# Altium project Filter.PrjPcb
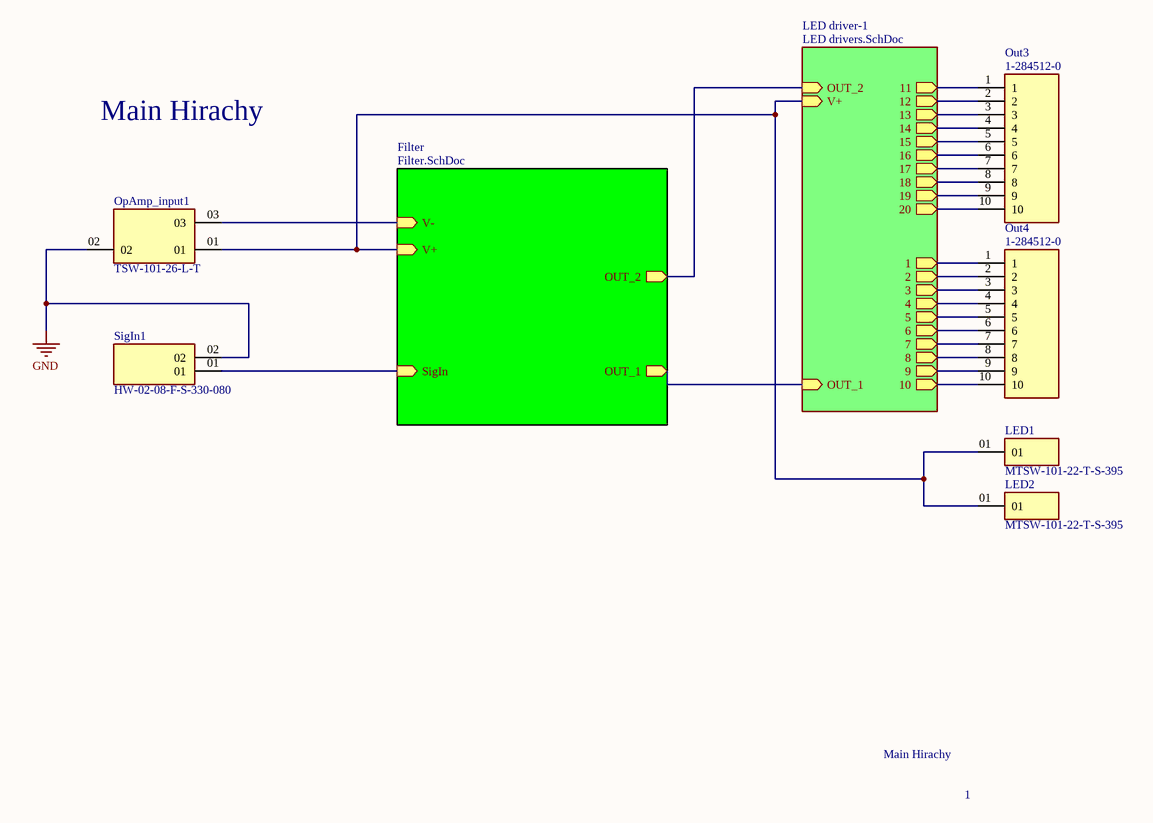
[diagram p0: main.SchDoc]
3 sheets, 29 parts. Net scope: hierarchical (ports join the sheet entries above them; power ports are global).
Board file: PCB_Filter.PcbDoc
Sheets:
  main.SchDoc
    Filter = Filter.SchDoc
    LED driver-1 = LED drivers.SchDoc

## Sheet main.SchDoc
size A4; SheetNumber: 1; SheetTotal: 3

### Parts
LED1  MTSW-101-22-T-S-395  [SAMTEC_MTSW-101-22-T-S-395]
LED2  MTSW-101-22-T-S-395  [SAMTEC_MTSW-101-22-T-S-395]
OpAmp_input1  TSW-101-26-L-T  [SAMTEC_TSW-101-26-L-T]
Out3  1-284512-0  [TE_1-284512-0]
Out4  1-284512-0  [TE_1-284512-0]
SigIn1  HW-02-08-F-S-330-080  [SAMTEC_HW-02-08-F-S-330-080]

### Sub-sheets
Filter = Filter.SchDoc: OUT_1 (out), OUT_2 (out), SigIn (in), V+ (in), V- (in)
LED driver-1 = LED drivers.SchDoc: 10 (out), 9 (out), 8 (out), 7 (out), 6 (out), 5 (out), 4 (out), 3 (out), 2 (out), 1 (out), OUT_1 (in), 20 (out), 19 (out), 18 (out), 17 (out), 16 (out), 15 (out), 14 (out), 13 (out), 12 (out), 11 (out), OUT_2 (in), V+ (in)

### Nets
GND: OpAmp_input1.02 SigIn1.02
Out1: sheet Filter/OUT_1, sheet LED driver-1/OUT_1
Out2: sheet Filter/OUT_2, sheet LED driver-1/OUT_2
NetIC3_1: Out4.1 ; sheet LED driver-1/1
NetIC3_3: LED1.01 LED2.01 OpAmp_input1.01 ; sheet Filter/V+, sheet LED driver-1/V+
NetIC3_10: Out4.10 ; sheet LED driver-1/10
NetIC3_11: Out4.9 ; sheet LED driver-1/9
NetIC3_12: Out4.8 ; sheet LED driver-1/8
NetIC3_13: Out4.7 ; sheet LED driver-1/7
NetIC3_14: Out4.6 ; sheet LED driver-1/6
NetIC3_15: Out4.5 ; sheet LED driver-1/5
NetIC3_16: Out4.4 ; sheet LED driver-1/4
NetIC3_17: Out4.3 ; sheet LED driver-1/3
NetIC3_18: Out4.2 ; sheet LED driver-1/2
NetIC4_1: Out3.1 ; sheet LED driver-1/11
NetIC4_10: Out3.10 ; sheet LED driver-1/20
NetIC4_11: Out3.9 ; sheet LED driver-1/19
NetIC4_12: Out3.8 ; sheet LED driver-1/18
NetIC4_13: Out3.7 ; sheet LED driver-1/17
NetIC4_14: Out3.6 ; sheet LED driver-1/16
NetIC4_15: Out3.5 ; sheet LED driver-1/15
NetIC4_16: Out3.4 ; sheet LED driver-1/14
NetIC4_17: Out3.3 ; sheet LED driver-1/13
NetIC4_18: Out3.2 ; sheet LED driver-1/12
NetOpAmp_input1_03: OpAmp_input1.03 ; sheet Filter/V-
NetR14_1: SigIn1.01 ; sheet Filter/SigIn

### Notes on the sheet
- Main Hirachy
- 1

### Library data of the parts
LED1 LED2 = MTSW-101-22-T-S-395: Connector Header Through Hole 1 position; MF: Samtec; Package: None; Value: *; Check_prices: https://www.snapeda.com/parts/MTSW-101-22-T-S-395/Samtec/view-part/?ref=eda; SnapEDA_Link: https://www.snapeda.com/parts/MTSW-101-22-T-S-395/Samtec/view-part/?ref=snap; Availability: In Stock; Price: None; MP: MTSW-101-22-T-S-395; Purchase-URL: https://pricing.snapeda.com/search/part/MTSW-101-22-T-S-395/?ref=eda
Out3 Out4 = 1-284512-0: 10 POS TERMI-BLOK HDR 900 POLA; Number_of_Positions: 10; MF: TE Connectivity; Centerline_Pitch: 3.5 mm[.138 in]; Package: None; TE_purchase_URL: https://www.te.com/usa-en/product-1-284512-0.html?te_bu=Cor&te_type=disp&te_campaign=seda_glo_cor-seda-global-disp-prtnr-fy19-seda-model-bom-cta_sma-317_1&elqCampaignId=32493; Value: *; SnapEDA_Link: https://www.snapeda.com/parts/1-284512-0/TE%20Connectivity%20AMP%20Connectors/view-part/2366032/?ref=snap; Price: None; MP: 1-284512-0; Availability: Unavailable; EU_RoHS_Compliance: Compliant
OpAmp_input1 = TSW-101-26-L-T: Package: None; Price: None; Value: *; MP: TSW-101-26-L-T; Availability: Unavailable
SigIn1 = HW-02-08-F-S-330-080: Availability: Unavailable; Price: None; Package: None; MP: HW-02-08-F-S-330-080; Value: *

## Sheet Filter.SchDoc
size A4; SheetNumber: 2; SheetTotal: 3
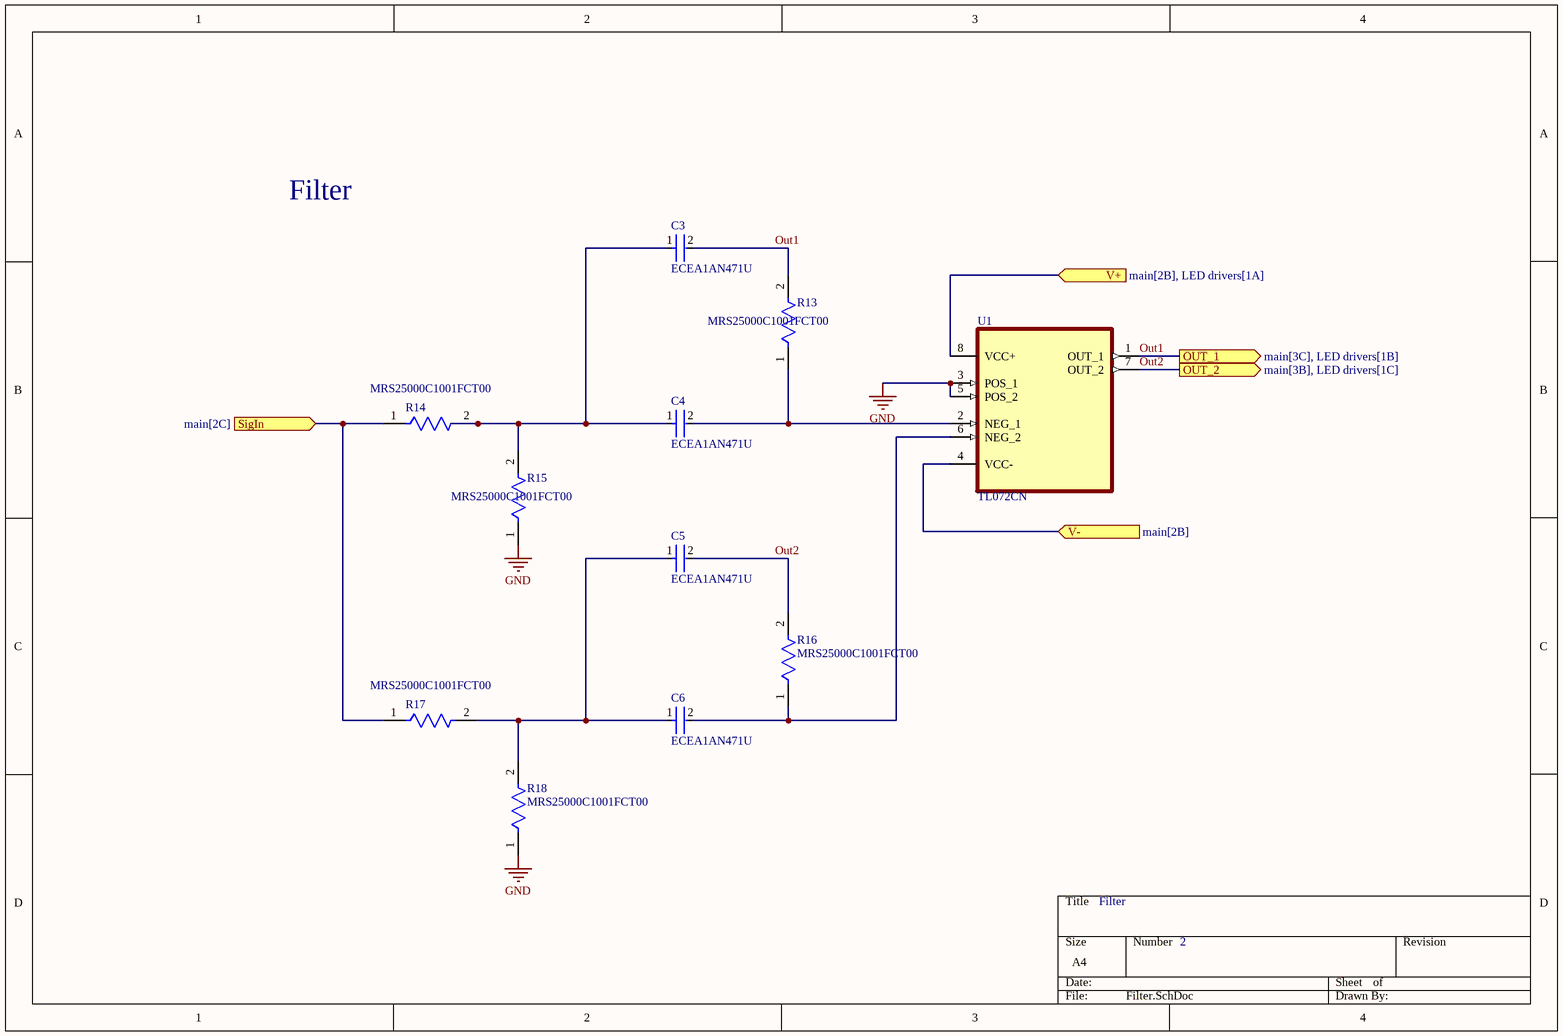
[diagram p1: Filter.SchDoc]

### Parts
C3  ECEA1AN471U  [FP-RAD-TH-D_10_0_5-L_16_1-MFG]
C4  ECEA1AN471U  [FP-RAD-TH-D_10_0_5-L_16_1-MFG]
C5  ECEA1AN471U  [FP-RAD-TH-D_10_0_5-L_16_1-MFG]
C6  ECEA1AN471U  [FP-RAD-TH-D_10_0_5-L_16_1-MFG]
R13  MRS25000C1001FCT00  [FP-MRS25-MFG]
R14  MRS25000C1001FCT00  [FP-MRS25-MFG]
R15  MRS25000C1001FCT00  [FP-MRS25-MFG]
R16  MRS25000C1001FCT00  [FP-MRS25-MFG]
R17  MRS25000C1001FCT00  [FP-MRS25-MFG]
R18  MRS25000C1001FCT00  [FP-MRS25-MFG]
U1  TL072CN  [DIP254P762X533-8]

### Ports
OUT_1 (out, see main[3C], LED drivers[1B]), OUT_2 (out, see main[3B], LED drivers[1C]), SigIn (in, see main[2C]), V+ (in, see main[2B], LED drivers[1A]), V- (in, see main[2B])

### Nets
GND: R15.1 R18.1 U1.3(POS_1) U1.5(POS_2)
Out1: C3.2 R13.2 U1.1(OUT_1) ; port OUT_1
Out2: C5.2 R16.2 U1.7(OUT_2) ; port OUT_2
NetC3_1: C3.1 C4.1 R14.2 R15.2
NetC4_2: C4.2 R13.1 U1.2(NEG_1)
NetC5_1: C5.1 C6.1 R17.2 R18.2
NetC6_2: C6.2 R16.1 U1.6(NEG_2)
NetIC3_3: U1.8(VCC+) ; port V+
NetOpAmp_input1_03: U1.4(VCC-) ; port V-
NetR14_1: R14.1 R17.1 ; port SigIn

### Notes on the sheet
- Filter
- 2

### Library data of the parts
C3-C6 = CMP-05427-001928-1: Aluminum Electrolytic Capacitors (Radial Lead Type) 470uF ±20% 10V; Lead Diameter: 0.6mm; Dissipation Factor: 0.25%; Life (Hours): 2000Hour; Leakage Current: 3uA; Ripple Current: 340mA; Mount: Through Hole; REACH SVHC: No SVHC; Height: 16mm; Max Operating Temperature: 85°C; Case/Package: Radial; Packaging: Bulk; RoHS Compliant: Yes; Min Operating Temperature: -40°C; Termination: Radial; Height - Seated (Max): 0.63inch; Series: SU; Construction: RADIAL; Capacitance: 470uF; Tolerance: 20%; Radiation Hardening: No; Voltage Rating (DC): 10V; Lead Free: Lead Free; Diameter: 10mm; Lead Pitch: 5mm; Voltage Rating: 10V; Length: 16mm; Voltage: 10V; Package Quantity: 200
R13-R18 = CMP-02408-000051-1: RES 1K OHM 0.6W 1% AXIAL; Power Rating: 600mW; Lead Diameter: 0.6mm; Voltage Rating (DC): 350V; Resistance: 1kR; Temperature Coefficient: 50ppm/°C; Width: 2.5mm; Military Standard: Not; Package Quantity: 5000; Radiation Hardening: No; Case/Package: Axial; Resistance Tolerance: 1%; Resistor Type: Metal Film; Contact Plating: Tin; Length: 6.5mm; Lead Free: Lead Free; RoHS Compliant: Yes; Mount: Through Hole; Number of Pins: 2; Technology: THIN FILM; Voltage Rating: 350V; Min Operating Temperature: -55°C; Weight: 0.00776oz; Diameter: 2.5mm; Construction: Cylindrical; Series: MRS25; Tolerance: 1%; Packaging: Tape and Reel; Max Operating Temperature: 155°C; Max Power Dissipation: 600mW; Number of Terminations: 2; Termination: Axial
U1 = TL072CN: J-FET Amplifier 2 Circuit 8-DIP; MF: Texas Instruments; Price: None; Package: DIP-8 Texas Instruments; MP: TL072CN; Value: *; Availability: Unavailable; SnapEDA_Link: https://www.snapeda.com/parts/TL072CN/Texas%20Instruments/view-part/576842/?ref=snap

## Sheet LED drivers.SchDoc
size A4; SheetNumber: 3; SheetTotal: 3
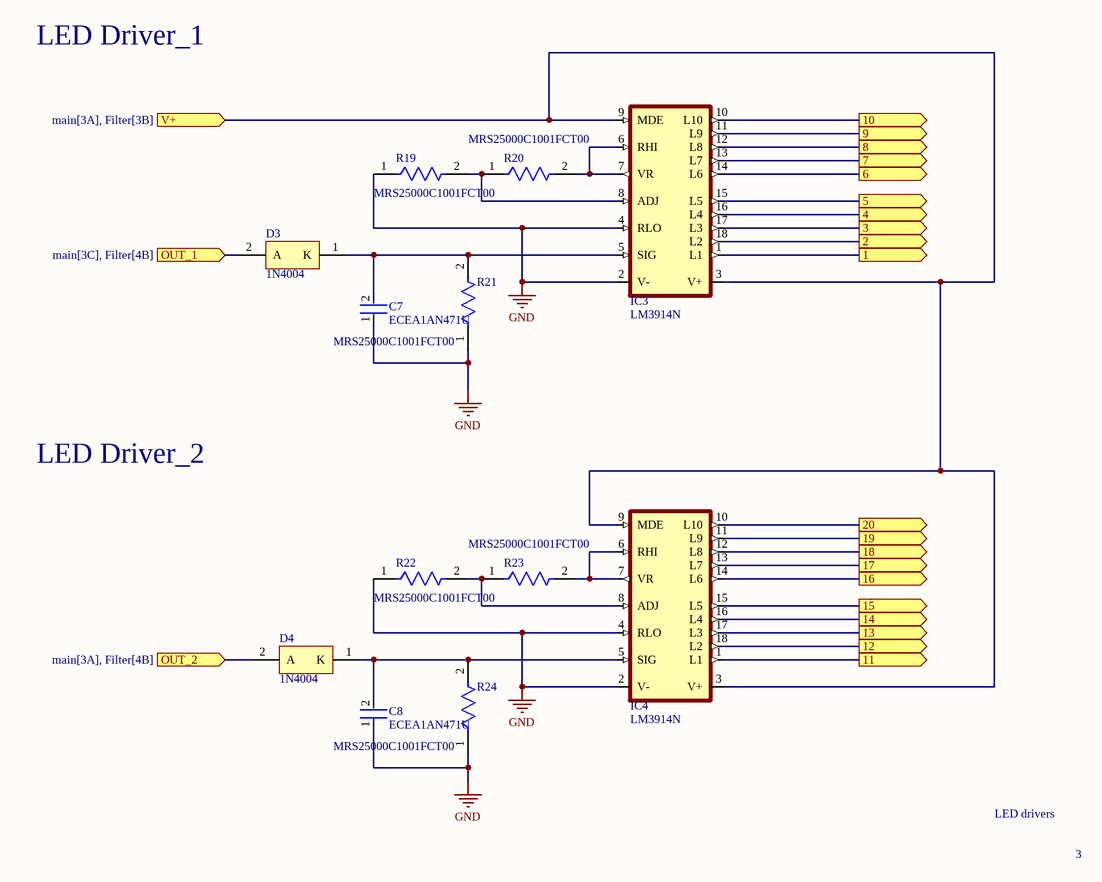
[diagram p2: LED drivers.SchDoc]

### Parts
C7  ECEA1AN471U  [FP-RAD-TH-D_10_0_5-L_16_1-MFG]
C8  ECEA1AN471U  [FP-RAD-TH-D_10_0_5-L_16_1-MFG]
D3  1N4004  [ONSC-AXIAL_LEAD-2-59-10_P]
D4  1N4004  [ONSC-AXIAL_LEAD-2-59-10_P]
IC3  LM3914N  [DIL18]
IC4  LM3914N  [DIL18]
R19  MRS25000C1001FCT00  [FP-MRS25-MFG]
R20  MRS25000C1001FCT00  [FP-MRS25-MFG]
R21  MRS25000C1001FCT00  [FP-MRS25-MFG]
R22  MRS25000C1001FCT00  [FP-MRS25-MFG]
R23  MRS25000C1001FCT00  [FP-MRS25-MFG]
R24  MRS25000C1001FCT00  [FP-MRS25-MFG]

### Ports
1 (out, see main[3B]), 2 (out, see main[3B]), 3 (out, see main[3B]), 4 (out, see main[3B]), 5 (out, see main[3B]), 6 (out, see main[3B]), 7 (out, see main[3B]), 8 (out, see main[3B]), 9 (out, see main[3C]), 10 (out, see main[3C]), 11 (out, see main[3A]), 12 (out, see main[3A]), 13 (out, see main[3B]), 14 (out, see main[3B]), 15 (out, see main[3B]), 16 (out, see main[3B]), 17 (out, see main[3B]), 18 (out, see main[3B]), 19 (out, see main[3B]), 20 (out, see main[3B]), OUT_1 (in, see main[3C], Filter[4B]), OUT_2 (in, see main[3A], Filter[4B]), V+ (in, see main[3A], Filter[3B])

### Nets
GND: C7.1 C8.1 IC3.2(V-) IC3.4(RLO) IC4.2(V-) IC4.4(RLO) R19.1 R21.1 R22.1 R24.1
Out1: D3.2(A) ; port OUT_1
Out2: D4.2(A) ; port OUT_2
NetC7_2: C7.2 D3.1(K) IC3.5(SIG) R21.2
NetC8_2: C8.2 D4.1(K) IC4.5(SIG) R24.2
NetIC3_1: IC3.1(L1) ; port 1
NetIC3_3: IC3.3(V+) IC3.9(MDE) IC4.3(V+) IC4.9(MDE) ; port V+
NetIC3_6: IC3.6(RHI) IC3.7(VR) R20.2
NetIC3_8: IC3.8(ADJ) R19.2 R20.1
NetIC3_10: IC3.10(L10) ; port 10
NetIC3_11: IC3.11(L9) ; port 9
NetIC3_12: IC3.12(L8) ; port 8
NetIC3_13: IC3.13(L7) ; port 7
NetIC3_14: IC3.14(L6) ; port 6
NetIC3_15: IC3.15(L5) ; port 5
NetIC3_16: IC3.16(L4) ; port 4
NetIC3_17: IC3.17(L3) ; port 3
NetIC3_18: IC3.18(L2) ; port 2
NetIC4_1: IC4.1(L1) ; port 11
NetIC4_6: IC4.6(RHI) IC4.7(VR) R23.2
NetIC4_8: IC4.8(ADJ) R22.2 R23.1
NetIC4_10: IC4.10(L10) ; port 20
NetIC4_11: IC4.11(L9) ; port 19
NetIC4_12: IC4.12(L8) ; port 18
NetIC4_13: IC4.13(L7) ; port 17
NetIC4_14: IC4.14(L6) ; port 16
NetIC4_15: IC4.15(L5) ; port 15
NetIC4_16: IC4.16(L4) ; port 14
NetIC4_17: IC4.17(L3) ; port 13
NetIC4_18: IC4.18(L2) ; port 12

### Notes on the sheet
- LED Driver_1
- LED Driver_2
- LED drivers
- 3

### Library data of the parts
C7 C8 = CMP-05427-001928-1: as C3 on sheet Filter; Mount: Through Hole; REACH SVHC: No SVHC; Height: 16mm; Max Operating Temperature: 85°C; Case/Package: Radial; Packaging: Bulk; RoHS Compliant: Yes; Min Operating Temperature: -40°C; Termination: Radial; Height - Seated (Max): 0.63inch; Series: SU; Construction: RADIAL; Capacitance: 470uF; Tolerance: 20%; Radiation Hardening: No; Voltage Rating (DC): 10V; Lead Free: Lead Free; Diameter: 10mm; Lead Pitch: 5mm; Voltage Rating: 10V; Length: 16mm; Voltage: 10V; Package Quantity: 200
D3 D4 = CMP-0902-00115-1: Standard Recovery Rectifier, 2-Pin Axial_Lead, Pb-Free, Bulk Bag; Manufacturer: On Semiconductor; IFSM Max (A): 30; IO(rec) Max (A): 1; VRRM Max (V): 400; Type: Standard Recovery; Packing: Bulk Bag; PackageVersion: Rev. U, 02/2005; ComponentLink1URL: http://www.onsemi.com/; ComponentLink3URL: http://www.onsemi.cn/pub_link/Collateral/59-10.PDF; DatasheetVersion: Rev. 13; PartNumber: 1N4004; ComponentLink1Description: Manufacturer URL; Mounting Technology: Through Hole; PackageReference: AXIAL_LEAD-2-59-10; ComponentLink3Description: Package Specification; ComponentLink2URL: http://www.onsemi.com/pub_link/Collateral/1N4001-D.PDF; ComponentLink2Description: Datasheet; PackageDescription: 2-Pin, Axial Lead, Diameter 2.35 mm; RoHS: TRUE
IC3 IC4 = LM3914N: LED Lighting Drivers; MF: Texas Instruments; MP: LM3914N; Package: None; Price: None; Availability: Unavailable; Value: *; SnapEDA_Link: https://www.snapeda.com/parts/LM3914N/Texas%20Instruments/view-part/4652973/?ref=snap
R19-R24 = CMP-02408-000051-1: as R13 on sheet Filter; Width: 2.5mm; Military Standard: Not; Package Quantity: 5000; Radiation Hardening: No; Case/Package: Axial; Resistance Tolerance: 1%; Resistor Type: Metal Film; Contact Plating: Tin; Length: 6.5mm; Lead Free: Lead Free; RoHS Compliant: Yes; Mount: Through Hole; Number of Pins: 2; Technology: THIN FILM; Voltage Rating: 350V; Min Operating Temperature: -55°C; Weight: 0.00776oz; Diameter: 2.5mm; Construction: Cylindrical; Series: MRS25; Tolerance: 1%; Packaging: Tape and Reel; Max Operating Temperature: 155°C; Max Power Dissipation: 600mW; Number of Terminations: 2; Termination: Axial

## Nets that join several sheets
GND: main (OpAmp_input1.02 SigIn1.02), Filter (R15.1 R18.1 U1.3 U1.5), LED drivers (10 pins)
NetIC3_1: main (Out4.1), LED drivers (IC3.1)
NetIC3_3: main (LED1.01 LED2.01 OpAmp_input1.01), Filter (U1.8), LED drivers (IC3.3 IC3.9 IC4.3 IC4.9)
NetIC3_10: main (Out4.10), LED drivers (IC3.10)
NetIC3_11: main (Out4.9), LED drivers (IC3.11)
NetIC3_12: main (Out4.8), LED drivers (IC3.12)
NetIC3_13: main (Out4.7), LED drivers (IC3.13)
NetIC3_14: main (Out4.6), LED drivers (IC3.14)
NetIC3_15: main (Out4.5), LED drivers (IC3.15)
NetIC3_16: main (Out4.4), LED drivers (IC3.16)
NetIC3_17: main (Out4.3), LED drivers (IC3.17)
NetIC3_18: main (Out4.2), LED drivers (IC3.18)
NetIC4_1: main (Out3.1), LED drivers (IC4.1)
NetIC4_10: main (Out3.10), LED drivers (IC4.10)
NetIC4_11: main (Out3.9), LED drivers (IC4.11)
NetIC4_12: main (Out3.8), LED drivers (IC4.12)
NetIC4_13: main (Out3.7), LED drivers (IC4.13)
NetIC4_14: main (Out3.6), LED drivers (IC4.14)
NetIC4_15: main (Out3.5), LED drivers (IC4.15)
NetIC4_16: main (Out3.4), LED drivers (IC4.16)
NetIC4_17: main (Out3.3), LED drivers (IC4.17)
NetIC4_18: main (Out3.2), LED drivers (IC4.18)
NetOpAmp_input1_03: main (OpAmp_input1.03), Filter (U1.4)
NetR14_1: main (SigIn1.01), Filter (R14.1 R17.1)
Out1: Filter (C3.2 R13.2 U1.1), LED drivers (D3.2)
Out2: Filter (C5.2 R16.2 U1.7), LED drivers (D4.2)